# Altium schematic sheet Connector.SchDoc
size 420 x 297 mm
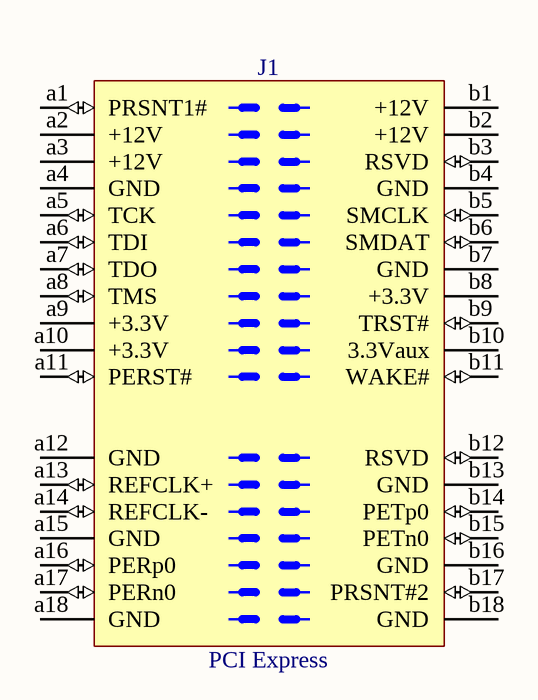
[diagram p0: Connector.SchDoc]

## Parts
J1  PCI Express  [PCI Express x1]

## Nets

Not connected (* = marked no-connect by the designer): J1 a1(PRSNT1#) a2(+12V) a3(+12V) a4(GND) a5(TCK) a6(TDI) a7(TDO) a8(TMS) a9(+3.3V) a10(+3.3V) a11(PERST#) a12(GND) a13(REFCLK+) a14(REFCLK-) a15(GND) a16(PERp0) a17(PERn0) a18(GND) b1(+12V) b2(+12V) b3(RSVD) b4(GND) b5(SMCLK) b6(SMDAT) b7(GND) b8(+3.3V) b9(TRST#) b10(3.3Vaux) b11(WAKE#) b12(RSVD) b13(GND) b14(PETp0) b15(PETn0) b16(GND) b17(PRSNT#2) b18(GND)

## Notes on the sheet
- Project/Equipment
- Document
- Designer
- Drawn by
- Check.by
- File
- Last Mod.
- Print Date
- Sheet
- Size
- A3
- of
- Rev

## Library data of the parts
J1 = PCI Express x1: 36 contacts Board Eddge PCI Express x1 Connector; Manufacturer: PCI-SIG; Mounted: No; Table: Miscellaneous; Part Number: PCI Express x1; Component Kind: Standard; Component Type: Standard; Designator: PCI Express x1; Pin Count: 36; Family: PCI Express; Socket: No; SMD: No; Status: None; Part Description: 36 contacts Board Eddge PCI Express x1 Connector; ComponentHeight: 0mm; Datasheet: \\cern.ch\dfs\Applications\Altium\Datasheets\PCI Express x1.pdf; HelpURL: \\cern.ch\dfs\Applications\Altium\Datasheets\PCI Express x1.pdf; Author: CERN DEM JLC; CreateDate: 6/23/2009; LatestRevisionDate: 6/23/2009